# EAGLE schematic _HC_Thesis_Schematic.0f503704-76ca-4dae-937e-57e30101aeb6_LV1 (EAGLE 9.7.0)
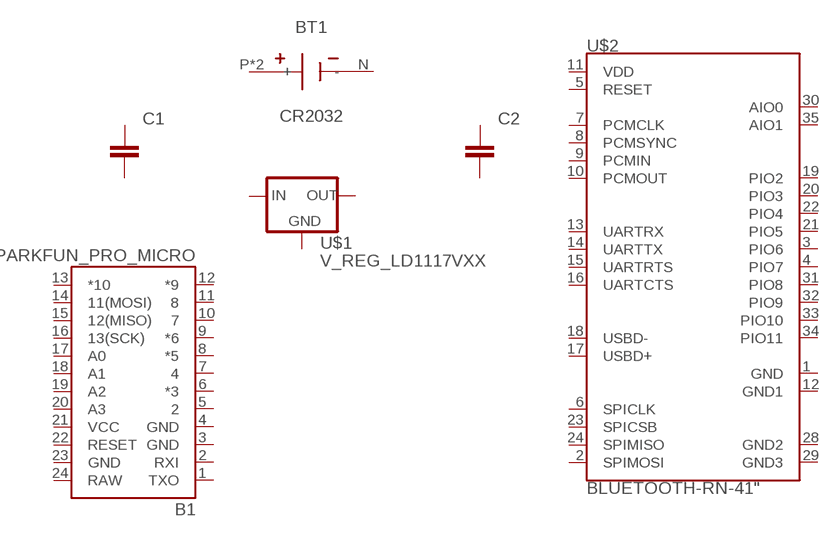
[diagram p0: schematic, sheet 1]

## Parts
B1  SPARKFUN_PRO_MICRO  [SPARKFUN_PRO_MICRO]
BT1  CR2032  COIN-CELL-SMT-3P-3002-CR2032  [BAT_3002]
C1  C_CHIP-0402(1005-METRIC)  [CAPC1005X60]
C2  C_CHIP-0402(1005-METRIC)  [CAPC1005X60]
U$1  V_REG_LD1117VXX  [78XXL]
U$2  BLUETOOTH-RN-41"  [RN41]
Unconnected: B1.1(TXO) B1.2(RXI) B1.5 B1.6(*3) B1.7 B1.8(*5) B1.9(*6) B1.10 B1.11 B1.12(*9) B1.13(*10) B1.14(11(MOSI)) B1.15(12(MISO)) B1.16(13(SCK)) B1.17(A0) B1.18(A1) B1.19(A2) B1.20(A3) B1.22(RESET) BT1.N(-) BT1.P1(+) BT1.P(+) C1.1 C1.2 C2.1 C2.2 U$1.GND(OUT) U$1.IN(GND) U$1.OUT(IN) U$2.1(GND) U$2.2(SPIMOSI) U$2.3(PIO6) U$2.4(PIO7) U$2.5(RESET) U$2.6(SPICLK) U$2.7(PCMCLK) U$2.8(PCMSYNC) U$2.9(PCMIN) U$2.10(PCMOUT) U$2.11(VDD) U$2.12(GND1) U$2.13(UARTRX) U$2.14(UARTTX) U$2.15(UARTRTS) U$2.16(UARTCTS) U$2.17(USBD+) U$2.18(USBD-) U$2.19(PIO2) U$2.20(PIO3) U$2.21(PIO5) U$2.22(PIO4) U$2.23(SPICSB) U$2.24(SPIMISO) U$2.28(GND2) U$2.29(GND3) U$2.30(AIO0) U$2.31(PIO8) U$2.32(PIO9) U$2.33(PIO10) U$2.34(PIO11) U$2.35(AIO1)

## Power pins joined to a net without a drawn wire
GND: B1.3(GND) B1.4(GND) B1.23(GND)
RAW: B1.24(RAW)
VCC: B1.21(VCC)

## Library data of the parts
B1 = SparkFun-Boards:SPARKFUN_PRO_MICRO: SparkFun Pro Micro Atmega32U4 compatible footprint. SparkFun Products: 3.3V/8MHz <https://www.sparkfun.com/products/12587> 5V/16MHz <https://www.sparkfun.com/products/12640>
BT1 = Battery_Holder:COIN-CELL-SMT-3P-?-: Battery Holders - Coin Cell SMD - CR2032, LR44, SR44 etc. Datasheet <https://docs.rs-online.com/b397/0900766b813ec0e2.pdf>; CATEGORY: Battery-Holder; CELL_DIAMETER: 20mm; DESCRIPTION: Battery Retainer Coin, 20.0mm 1 Cell SMD (SMT) Tab; MANUFACTURER: Keystone Electronics; MPN: 3002; PART_STATUS: ACTIVE; ROHS_COMPLIANT: COMPLIANT; SERIES: -; SUB_CATEGORY: Holder; TYPE: Coin Cell
C1 C2 = Capacitor:C: Capacitor - Generic; CATEGORY: Capacitor
U$1 = SparkFun-IC-Power:V_REG_LD1117VXX: LD1117VXX voltage regulator. We carry the 3.3V version (COM-00526) in TO-220 package.
U$2 = SparkFun-RF:BLUETOOTH-RN-41: Roving Networks RN-41 Bluetooth Module The RN-41 module is a small form factor, low power, class 1 Bluetooth radio that is ideal for designers who want to add wireless capability to their products without spending significant time and money developing Bluetooth-specific hardware and software. The RN-41 supports multiple interface protocols, is simple to design in, and is fully certified, making it a complete embedded Bluetooth solution. SparkFun Products: Bluetooth SMD Module - RN-41 <https://www.sparkfun.com/products/12575> (WRL-12575) Bluetooth Module Breakout - Roving Networks (RN-41 v6.15) <https://www.sparkfun.com/products/12579> (WRL-12579); PROD_ID: IC-11844; SF_ID: WRL-12575